# Altium schematic sheet Light.SchDoc
size A3; DocumentNumber: 1; SheetNumber: 1; SheetTotal: 1
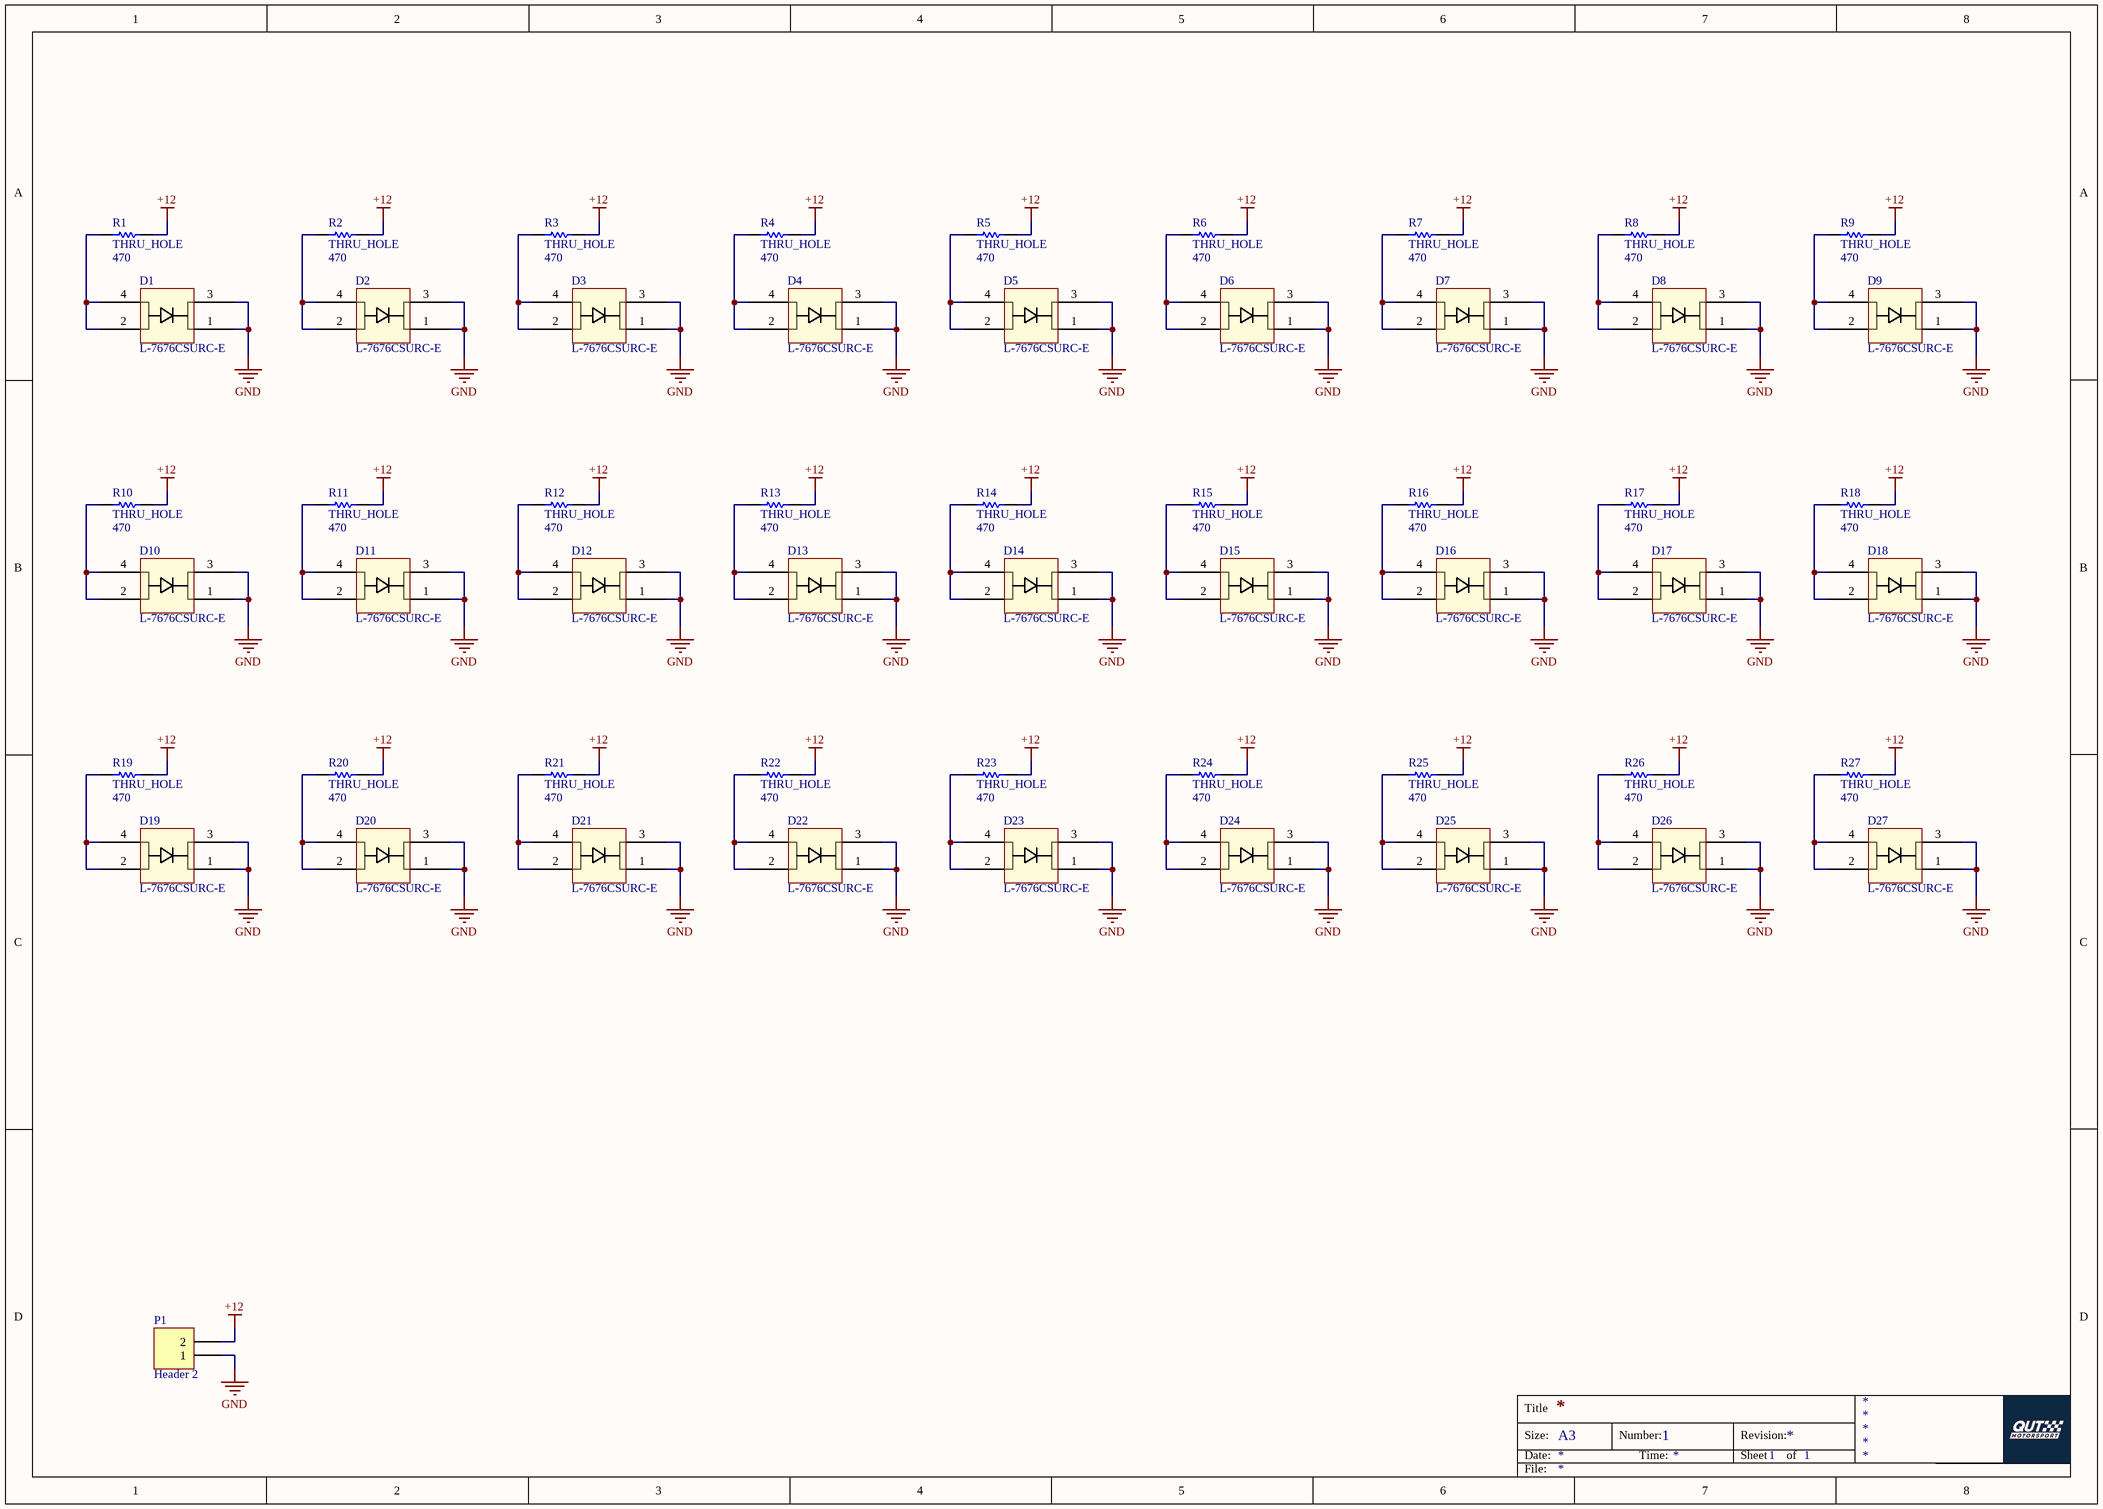
[diagram p0: Light.SchDoc]

## Parts
D1  L-7676CSURC-E  [L-7676CSURC-E]
D2  L-7676CSURC-E  [L-7676CSURC-E]
D3  L-7676CSURC-E  [L-7676CSURC-E]
D4  L-7676CSURC-E  [L-7676CSURC-E]
D5  L-7676CSURC-E  [L-7676CSURC-E]
D6  L-7676CSURC-E  [L-7676CSURC-E]
D7  L-7676CSURC-E  [L-7676CSURC-E]
D8  L-7676CSURC-E  [L-7676CSURC-E]
D9  L-7676CSURC-E  [L-7676CSURC-E]
D10  L-7676CSURC-E  [L-7676CSURC-E]
D11  L-7676CSURC-E  [L-7676CSURC-E]
D12  L-7676CSURC-E  [L-7676CSURC-E]
D13  L-7676CSURC-E  [L-7676CSURC-E]
D14  L-7676CSURC-E  [L-7676CSURC-E]
D15  L-7676CSURC-E  [L-7676CSURC-E]
D16  L-7676CSURC-E  [L-7676CSURC-E]
D17  L-7676CSURC-E  [L-7676CSURC-E]
D18  L-7676CSURC-E  [L-7676CSURC-E]
D19  L-7676CSURC-E  [L-7676CSURC-E]
D20  L-7676CSURC-E  [L-7676CSURC-E]
D21  L-7676CSURC-E  [L-7676CSURC-E]
D22  L-7676CSURC-E  [L-7676CSURC-E]
D23  L-7676CSURC-E  [L-7676CSURC-E]
D24  L-7676CSURC-E  [L-7676CSURC-E]
D25  L-7676CSURC-E  [L-7676CSURC-E]
D26  L-7676CSURC-E  [L-7676CSURC-E]
D27  L-7676CSURC-E  [L-7676CSURC-E]
P1  Header 2  [HDR1X2]
R1  THRU_HOLE  value 470  [AXIAL-0.3]
R2  THRU_HOLE  value 470  [AXIAL-0.3]
R3  THRU_HOLE  value 470  [AXIAL-0.3]
R4  THRU_HOLE  value 470  [AXIAL-0.3]
R5  THRU_HOLE  value 470  [AXIAL-0.3]
R6  THRU_HOLE  value 470  [AXIAL-0.3]
R7  THRU_HOLE  value 470  [AXIAL-0.3]
R8  THRU_HOLE  value 470  [AXIAL-0.3]
R9  THRU_HOLE  value 470  [AXIAL-0.3]
R10  THRU_HOLE  value 470  [AXIAL-0.3]
R11  THRU_HOLE  value 470  [AXIAL-0.3]
R12  THRU_HOLE  value 470  [AXIAL-0.3]
R13  THRU_HOLE  value 470  [AXIAL-0.3]
R14  THRU_HOLE  value 470  [AXIAL-0.3]
R15  THRU_HOLE  value 470  [AXIAL-0.3]
R16  THRU_HOLE  value 470  [AXIAL-0.3]
R17  THRU_HOLE  value 470  [AXIAL-0.3]
R18  THRU_HOLE  value 470  [AXIAL-0.3]
R19  THRU_HOLE  value 470  [AXIAL-0.3]
R20  THRU_HOLE  value 470  [AXIAL-0.3]
R21  THRU_HOLE  value 470  [AXIAL-0.3]
R22  THRU_HOLE  value 470  [AXIAL-0.3]
R23  THRU_HOLE  value 470  [AXIAL-0.3]
R24  THRU_HOLE  value 470  [AXIAL-0.3]
R25  THRU_HOLE  value 470  [AXIAL-0.3]
R26  THRU_HOLE  value 470  [AXIAL-0.3]
R27  THRU_HOLE  value 470  [AXIAL-0.3]

## Nets
+12: P1.2 R1.2 R2.2 R3.2 R4.2 R5.2 R6.2 R7.2 R8.2 R9.2 R10.2 R11.2 R12.2 R13.2 R14.2 R15.2 R16.2 R17.2 R18.2 R19.2 R20.2 R21.2 R22.2 R23.2 R24.2 R25.2 R26.2 R27.2
GND: D1.1 D1.3 D2.1 D2.3 D3.1 D3.3 D4.1 D4.3 D5.1 D5.3 D6.1 D6.3 D7.1 D7.3 D8.1 D8.3 D9.1 D9.3 D10.1 D10.3 D11.1 D11.3 D12.1 D12.3 D13.1 D13.3 D14.1 D14.3 D15.1 D15.3 D16.1 D16.3 D17.1 D17.3 D18.1 D18.3 D19.1 D19.3 D20.1 D20.3 D21.1 D21.3 D22.1 D22.3 D23.1 D23.3 D24.1 D24.3 D25.1 D25.3 D26.1 D26.3 D27.1 D27.3 P1.1
NetD1_2: D1.2 D1.4 R1.1
NetD2_2: D2.2 D2.4 R2.1
NetD3_2: D3.2 D3.4 R3.1
NetD4_2: D4.2 D4.4 R4.1
NetD5_2: D5.2 D5.4 R5.1
NetD6_2: D6.2 D6.4 R6.1
NetD7_2: D7.2 D7.4 R7.1
NetD8_2: D8.2 D8.4 R8.1
NetD9_2: D9.2 D9.4 R9.1
NetD10_2: D10.2 D10.4 R10.1
NetD11_2: D11.2 D11.4 R11.1
NetD12_2: D12.2 D12.4 R12.1
NetD13_2: D13.2 D13.4 R13.1
NetD14_2: D14.2 D14.4 R14.1
NetD15_2: D15.2 D15.4 R15.1
NetD16_2: D16.2 D16.4 R16.1
NetD17_2: D17.2 D17.4 R17.1
NetD18_2: D18.2 D18.4 R18.1
NetD19_2: D19.2 D19.4 R19.1
NetD20_2: D20.2 D20.4 R20.1
NetD21_2: D21.2 D21.4 R21.1
NetD22_2: D22.2 D22.4 R22.1
NetD23_2: D23.2 D23.4 R23.1
NetD24_2: D24.2 D24.4 R24.1
NetD25_2: D25.2 D25.4 R25.1
NetD26_2: D26.2 D26.4 R26.1
NetD27_2: D27.2 D27.4 R27.1

## Notes on the sheet
- Title
- Size:
- Date:
- A3
- Number:
- Time:
- Revision:
- Sheet
- of
- File:

## Library data of the parts
P1 = Header 2: Header, 2-Pin; LatestRevisionDate: 17-Jul-2002; LatestRevisionNote: Re-released for DXP Platform.; Publisher: Altium Limited
R1-R27 = Res1: Resistor; Published: 8-Jun-2000; LatestRevisionDate: 17-Jul-2002; LatestRevisionNote: Re-released for DXP Platform.; PackageReference: AXIAL-0.3; Publisher: Altium Limited; PackageDescription: Axial Device, Thru-Hole; 2 Leads; 0.3 in Pin Spacing